# Altium schematic sheet STM32F103T8+DCDCLMR16030_SchDoc.SchDoc
size A; SheetNumber: 1; SheetTotal: 3
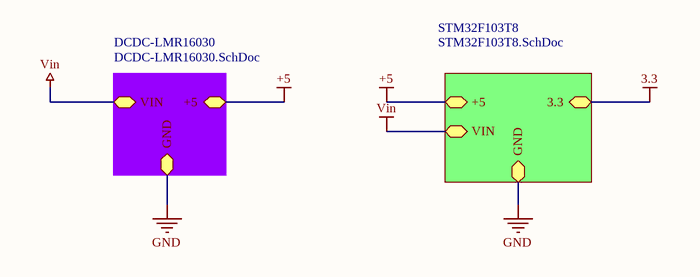
[diagram p0: STM32F103T8+DCDCLMR16030_SchDoc.SchDoc]

## Sub-sheets
DCDC-LMR16030 = DCDC-LMR16030.SchDoc: GND (bidir), VIN (bidir), +5 (bidir)
STM32F103T8 = STM32F103T8.SchDoc: GND (bidir), +5 (bidir), 3.3 (bidir), VIN (bidir)

## Nets
3.3: sheet STM32F103T8/3.3
+5: sheet DCDC-LMR16030/+5, sheet STM32F103T8/+5
GND: sheet DCDC-LMR16030/GND, sheet STM32F103T8/GND
Vin: sheet DCDC-LMR16030/VIN, sheet STM32F103T8/VIN